# Altium schematic sheet Schematic.SchDoc
size A4
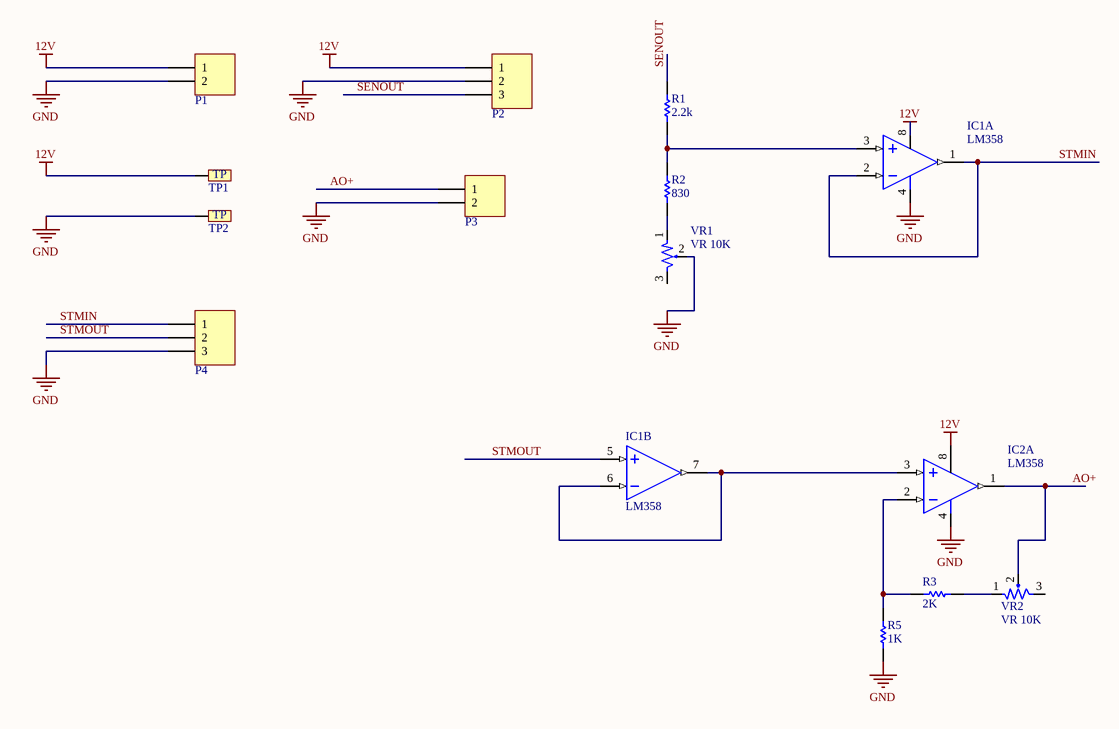
[diagram p0: Schematic.SchDoc]

## Parts
IC1  LM358  [DIP8]  (parts A,B of 2)
IC2  LM358  [DIP8]  (part A of 2)
P1  Header 2H  [JP2H]  (value not drawn)
P2  Header 3  [JP3]  (value not drawn)
P3  Header 2H  [JP2H]  (value not drawn)
P4  Header 3  [JP3]  (value not drawn)
R1  value 2.2k  [RES-SM-0805]  (hidden comment: RESISTOR SMD)
R2  value 830  [RES-SM-0805]  (hidden comment: RESISTOR SMD)
R3  value 2K  [RES-SM-0805]  (hidden comment: RESISTOR SMD)
R5  value 1K  [RES-SM-0805]  (hidden comment: RESISTOR SMD)
TP1  Test Point  [TP]  (value not drawn)
TP2  Test Point  [TP]  (value not drawn)
VR1  value VR 10K  [Varistor 1]  (hidden comment: 10K)
VR2  value VR 10K  [Varistor 1]  (hidden comment: 10K)

## Nets
12V: IC1.8(+V) IC2.8(+V) P1.1 P2.1 TP1.TP1
GND: IC1.4(-V) IC2.4(-V) P1.2 P2.2 P3.2 P4.3 R5.2 TP2.TP1 VR1.2
AO+: IC2.1(OUT) P3.1 VR2.2
SENOUT: P2.3 R1.2
STMIN: IC1.1(OUT) IC1.2(IN-) P4.1
STMOUT: IC1.5(IN+) P4.2
NetIC1_3: IC1.3(IN+) R1.1 R2.2
NetIC1_6: IC1.6(IN-) IC1.7(OUT) IC2.3(IN+)
NetIC2_2: IC2.2(IN-) R3.2 R5.1
NetR2_1: R2.1 VR1.1
NetR3_1: R3.1 VR2.1

Not connected (* = marked no-connect by the designer): VR1 3; VR2 3

## Notes on the sheet
- (in symbol Test Point) TP

## Library data of the parts
IC1 IC2 = LM358: Low-Power Dual Operational Amplifier; Value: LM358
P1 P3 = Header 2H: Header, 2-Pin, Right Angle; LatestRevisionDate: 17-Jul-2002; LatestRevisionNote: Re-released for DXP Platform.; Publisher: Altium Limited
P2 P4 = Header 3: Header, 3-Pin; LatestRevisionDate: 17-Jul-2002; LatestRevisionNote: Re-released for DXP Platform.; Publisher: Altium Limited
R1-R3 R5 = RESISTOR SMD: Resistor
VR1 VR2 = Var Resistor